# Altium schematic sheet MCU.SchDoc
size 420 x 297 mm; SheetNumber: 2; SheetTotal: 2
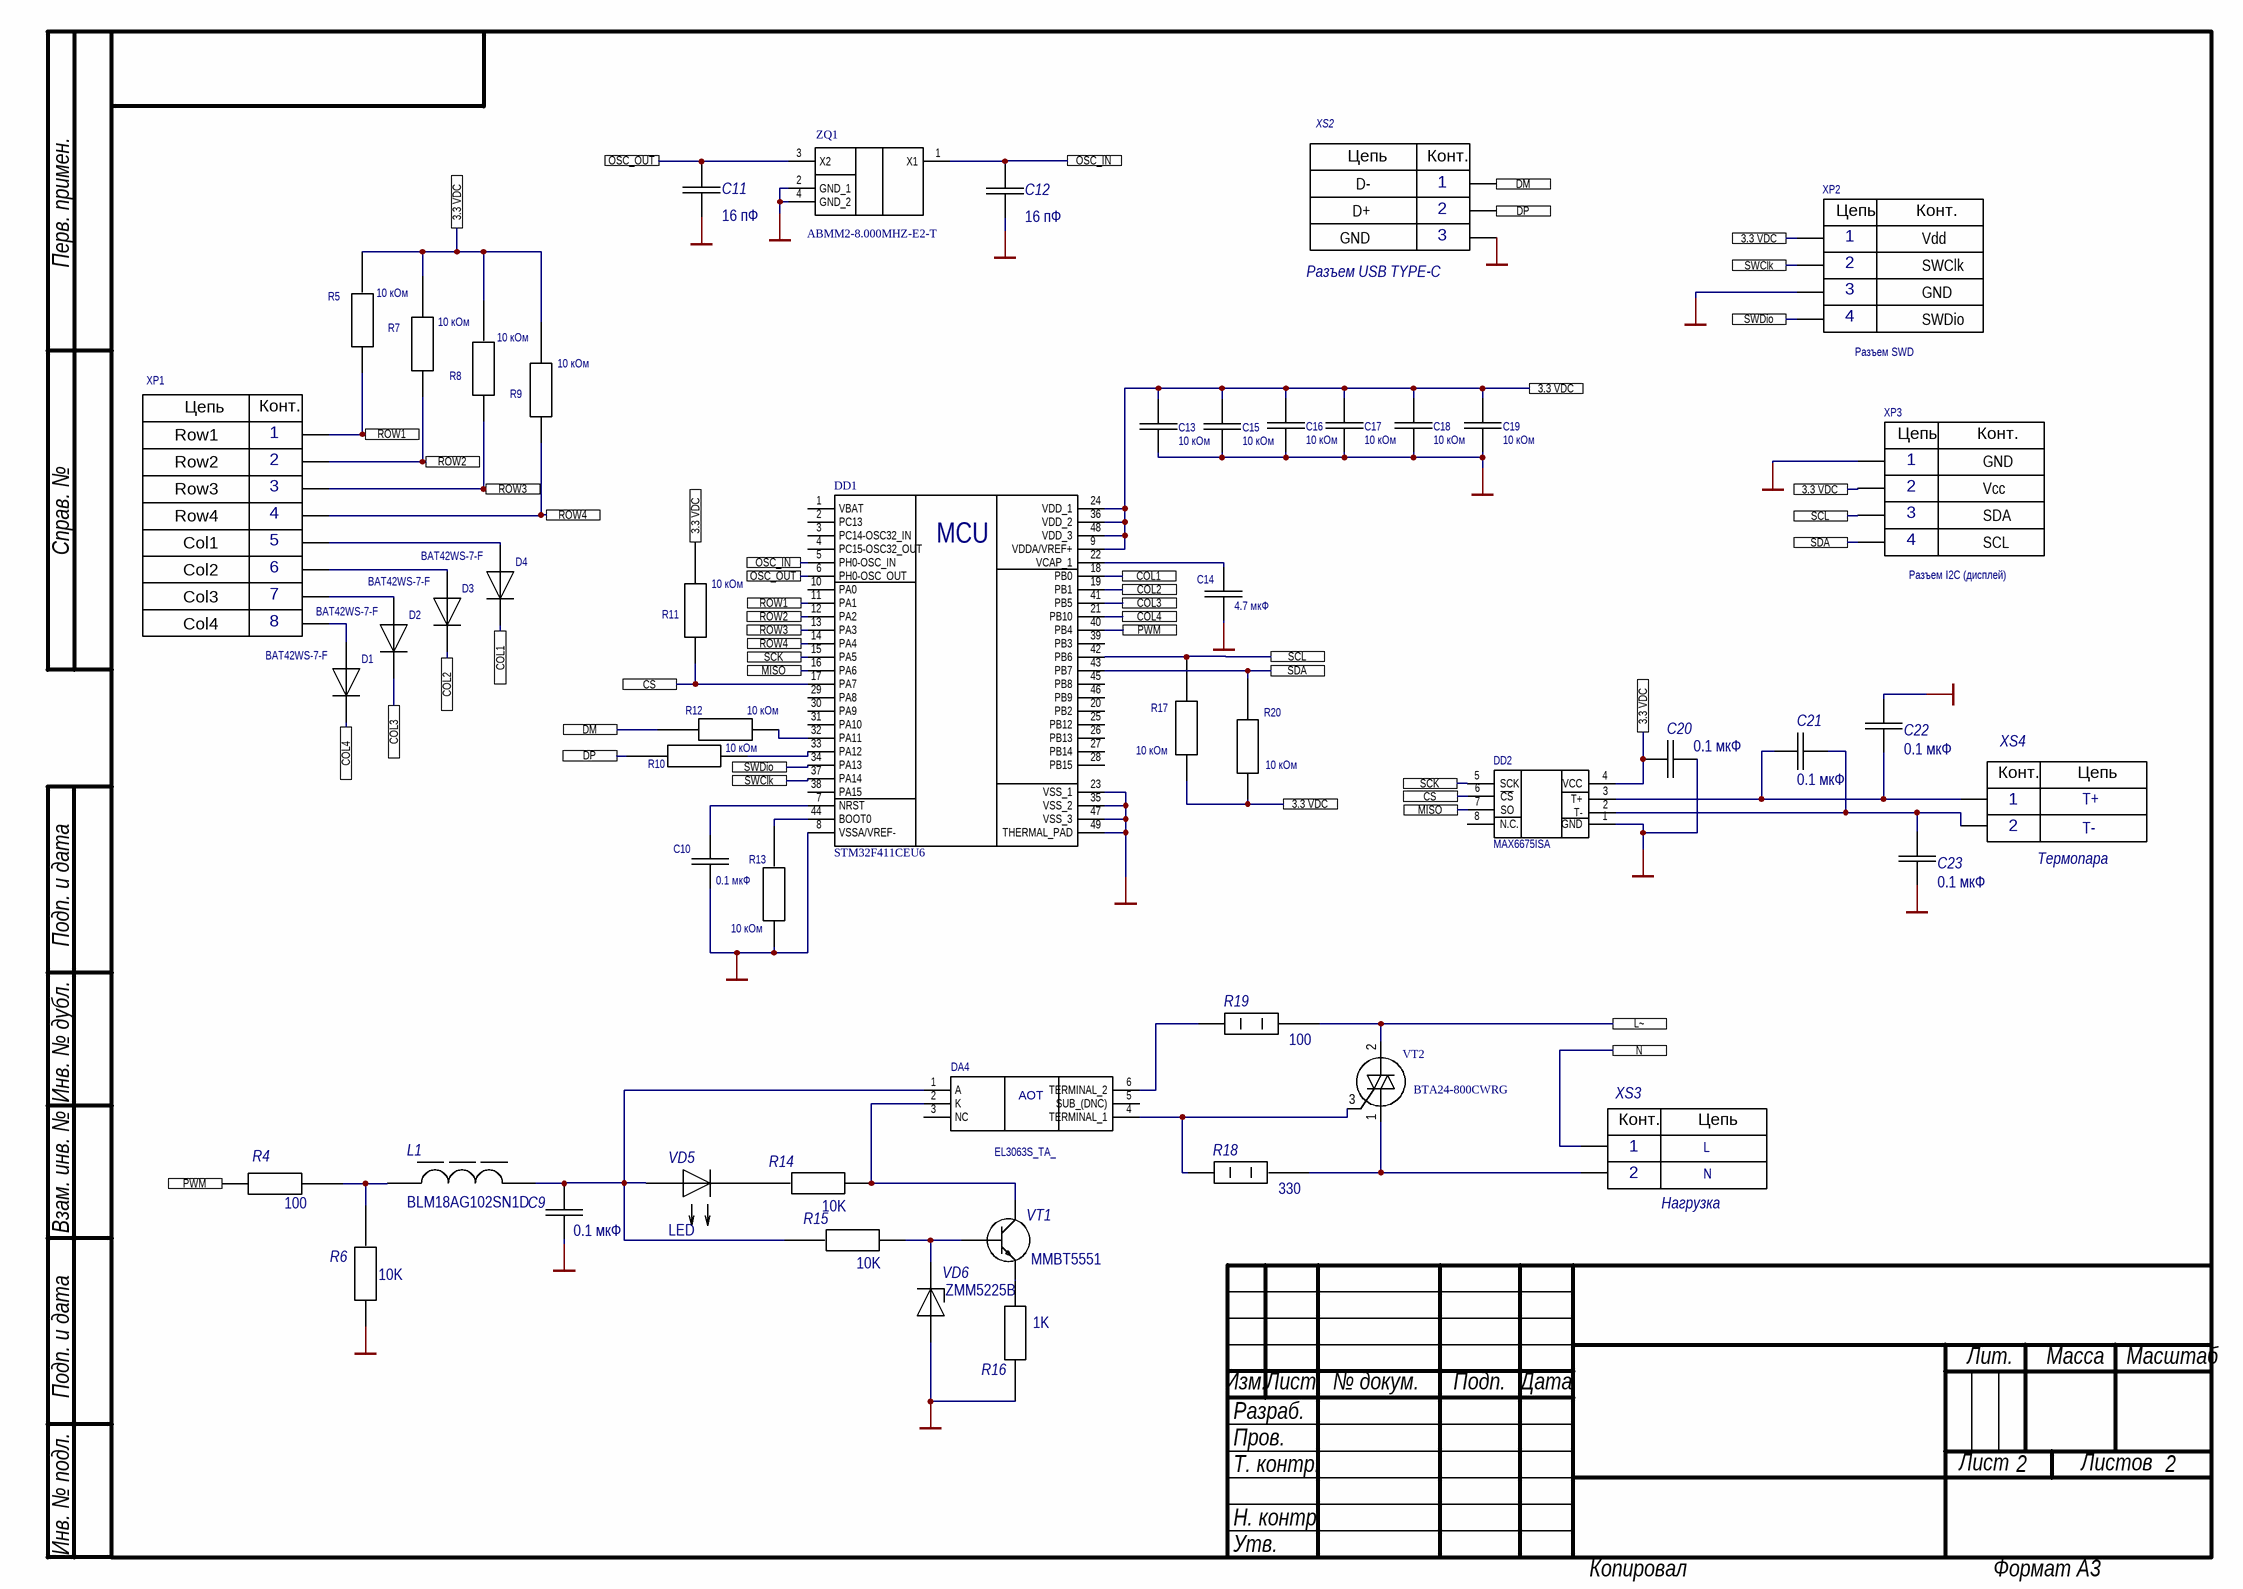
[diagram p0: MCU.SchDoc]

## Parts
C9  value 0.1 мкФ  [С0603]  (hidden comment: 06035C104JAT2A)
C10  value 0.1 мкФ  [С0603]  (hidden comment: 06035C104JAT2A)
C11  value 16 пФ  [C0402]  (hidden comment: CC0603JRNPO9BN160)
C12  value 16 пФ  [C0402]  (hidden comment: CC0603JRNPO9BN160)
C13  value 10 кОм  [С0603]  (hidden comment: 06035C104JAT2A)
C14  value 4.7 мкФ  [С0603]  (hidden comment: 06035C104JAT2A)
C15  value 10 кОм  [С0603]  (hidden comment: 06035C104JAT2A)
C16  value 10 кОм  [С0603]  (hidden comment: 06035C104JAT2A)
C17  value 10 кОм  [С0603]  (hidden comment: 06035C104JAT2A)
C18  value 10 кОм  [С0603]  (hidden comment: 06035C104JAT2A)
C19  value 10 кОм  [С0603]  (hidden comment: 06035C104JAT2A)
C20  value 0.1 мкФ  [С0603]  (hidden comment: 06035C104JAT2A)
C21  value 0.1 мкФ  [С0603]  (hidden comment: 06035C104JAT2A)
C22  value 0.1 мкФ  [С0603]  (hidden comment: 06035C104JAT2A)
C23  value 0.1 мкФ  [С0603]  (hidden comment: 06035C104JAT2A)
D1  BAT42WS-7-F  [SOD2513X120N]
D2  BAT42WS-7-F  [SOD2513X120N]
D3  BAT42WS-7-F  [SOD2513X120N]
D4  BAT42WS-7-F  [SOD2513X120N]
DA4  EL3063S_TA_  [SOP254P1030X460-6N]
DD1  STM32F411CEU6  [QFN50P700X700X60-49N-D]
DD2  MAX6675ISA  [SOIC127P600X175-8N]
L1  BLM18AG102SN1D  [BLM18SP221SN1B]
R4  value 100  [R0402]  (hidden comment: R0402)
R5  value 10 кОм  [R0402]  (hidden comment: R0402)
R6  value 10K  [R0402]  (hidden comment: R0402)
R7  value 10 кОм  [R0402]  (hidden comment: R0402)
R8  value 10 кОм  [R0402]  (hidden comment: R0402)
R9  value 10 кОм  [R0402]  (hidden comment: R0402)
R10  value 10 кОм  [R0402]  (hidden comment: R0402)
R11  value 10 кОм  [R0402]  (hidden comment: R0402)
R12  value 10 кОм  [R0402]  (hidden comment: R0402)
R13  value 10 кОм  [R0402]  (hidden comment: R0402)
R14  value 10K  [R0402]  (hidden comment: R0402)
R15  value 10K  [R0402]  (hidden comment: R0402)
R16  value 1K  [R0402]  (hidden comment: R0402)
R17  value 10 кОм  [R0402]  (hidden comment: R0402)
R18  value 330  [RESC5025X65N]  (hidden comment: RC2010JK-07330RL)
R19  value 100  [RESC5025X65N]  (hidden comment: RC2010FK-07100RL)
R20  value 10 кОм  [R0402]  (hidden comment: R0402)
VD5  LED  [LED Red 5 мм]
VD6  ZMM5225B  [TMMDB3TG]
VT1  MMBT5551  [MMBT5551]
VT2  BTA24-800CWRG  [TO255P460X1020X2005-3P]
XP1  PLS3  [PLS8]  (value not drawn)
XP2  Разъем SWD  [PLS4]
XP3  Разъем I2C (дисплей)  [PLS4]
XS2  Разъем USB TYPE-C  [Разъем USB TYPE-C, 1054500101]
XS3  Нагрузка  [ED350V-02P]
XS4  Термопара  [S2B-PH-K-S]
ZQ1  ABMM2-8.000MHZ-E2-T  [ABMM2]

## Ports
3.3 VDC, COL1, COL2, COL3, COL4, CS, DM, DP, L~, MISO, N, OSC_IN, OSC_OUT, PWM, ROW1, ROW2, ROW3, ROW4, SCK, SCL, SDA, SWClk, SWDio

## Nets
DGND: C9.1 C10.2 C11.2 C12.2 C13.1 C14.1 C15.1 C16.1 C17.1 C18.1 C19.1 C20.1 C22.2 C23.1 DD1.8(VSSA/VREF-) DD1.23(VSS_1) DD1.35(VSS_2) DD1.47(VSS_3) DD1.49(THERMAL_PAD) DD2.1(GND) R6.1 R13.1 R16.2 VD6.2(A) XP2.3(GND) XP3.1(GND) XS2.A1(GND) ZQ1.2(GND_1) ZQ1.4(GND_2)
3.3 VDC: C13.2 C15.2 C16.2 C17.2 C18.2 C19.2 C20.2 DD1.9(VDDA/VREF+) DD1.24(VDD_1) DD1.36(VDD_2) DD1.48(VDD_3) DD2.4(VCC) R5.2 R7.2 R8.2 R9.2 R11.2 R17.1 R20.1 XP2.1(Vdd) XP3.2(Vcc) ; port 3.3 VDC
COL1: D4.1(K) DD1.18(PB0) ; port COL1
COL2: D3.1(K) DD1.19(PB1) ; port COL2
COL3: D2.1(K) DD1.41(PB5) ; port COL3
COL4: D1.1(K) DD1.21(PB10) ; port COL4
CS: DD1.17(PA7) DD2.6(~{CS}) R11.1 ; port CS
DM: R12.2 XS2.A7(D-) ; port DM
DP: R10.2 XS2.A6(D+) ; port DP
L~: R19.2 VT2.2(A2) ; port L~
MISO: DD1.16(PA6) DD2.7(SO) ; port MISO
N: XS3.1 ; port N
OSC_IN: C12.1 DD1.5(PH0-OSC_IN) ZQ1.1(X1) ; port OSC_IN
OSC_OUT: C11.1 DD1.6(PH0-OSC_OUT) ZQ1.3(X2) ; port OSC_OUT
PWM: DD1.40(PB4) R4.1 ; port PWM
ROW1: DD1.11(PA1) R5.1 XP1.1(Row1) ; port ROW1
ROW2: DD1.12(PA2) R7.1 XP1.2(Row2) ; port ROW2
ROW3: DD1.13(PA3) R8.1 XP1.3(Row3) ; port ROW3
ROW4: DD1.14(PA4) R9.1 XP1.4(Row4) ; port ROW4
SCK: DD1.15(PA5) DD2.5(SCK) ; port SCK
SCL: DD1.42(PB6) R17.2 XP3.3(SDA) ; port SCL
SDA: DD1.43(PB7) R20.2 XP3.4(SCL) ; port SDA
SWClk: DD1.37(PA14) XP2.2(SWClk) ; port SWClk
SWDio: DD1.34(PA13) XP2.4(SWDio) ; port SWDio
NetC9_2: C9.2 DA4.1(A) L1.2 R15.2 VD5.1(ANODE)
NetC10_1: C10.1 DD1.7(NRST)
NetC14_2: C14.2 DD1.22(VCAP_1)
NetC21_1: C21.1 C22.1 DD2.3(T+) XS4.1
NetC21_2: C21.2 C23.2 DD2.2(T-) XS4.2
NetD1_2: D1.2(A) XP1.8(Col4)
NetD2_2: D2.2(A) XP1.7(Col3)
NetD3_2: D3.2(A) XP1.6(Col2)
NetD4_2: D4.2(A) XP1.5(Col1)
NetDA4_2: DA4.2(K) R14.1 VT1.3(C)
NetDA4_4: DA4.4(TERMINAL_1) R18.1 VT2.3(G)
NetDA4_6: DA4.6(TERMINAL_2) R19.1
NetDD1_32: DD1.32(PA11) R12.1
NetDD1_33: DD1.33(PA12) R10.1
NetDD1_44: DD1.44(BOOT0) R13.2
NetL1_1: L1.1 R4.2 R6.2
NetR14_2: R14.2 VD5.2(CATHODE)
NetR15_1: R15.1 VD6.1(K) VT1.1(B)
NetR16_1: R16.1 VT1.2(E)
NetR18_2: R18.2 VT2.1(A1) XS3.2

Not connected (* = marked no-connect by the designer): DA4 3(NC) 5(SUB_(DNC)); DD1 1(VBAT) 2(PC13) 3(PC14-OSC32_IN) 4(PC15-OSC32_OUT) 10(PA0) 20(PB2) 25(PB12) 26(PB13) 27(PB14) 28(PB15) 29(PA8) 30(PA9) 31(PA10) 38(PA15) 39(PB3) 45(PB8) 46(PB9); DD2 8(N.C.)

## Notes on the sheet
- T-
- T+
- L
- N
- Перв. примен.
- Справ. №
- Подп. и дата
- Инв. № дубл.
- Взам. инв. №
- Разраб.
- Изм.
- Лист
- № докум.
- Подп.
- Дата
- Лит.
- Масса
- Масштаб
- Пров.
- Т. контр.
- Листов
- Инв. № подл.
- Н. контр.
- Утв.
- Копировал
- Формат А3
- (in symbol EL3063S_TA_) АОТ
- (in symbol PLS8) Цепь; Конт.
- (in symbol STM32F411CEU6) MCU
- (in symbol Разъем) Конт.; Цепь
- (in symbol Разъем I2C (4)) Цепь; Конт.
- (in symbol Разъем SWD) Цепь; Конт.
- (in symbol Разъем USB TYPE-C) Цепь; Конт.; 1; 2; 3

## Library data of the parts
C9 C20-C23 = Конденсатор неполярный: Керамический ЧИП-конденсатор 0603 X7R 0.1мкФ ±5% 50В; Manufacturer_Name: KEMET; Manufacturer_Part_Number: CC0402KRX7R7BB222; Datasheet Link: https://componentsearchengine.com/Datasheets/34/CC0402KRX7R7BB222.pdf; Height: 0.55mm
C10 C13-C19 = Конденсатор неполярный: Capacitor; Manufacturer_Name: KEMET; Manufacturer_Part_Number: CC0402KRX7R7BB222; Datasheet Link: https://componentsearchengine.com/Datasheets/34/CC0402KRX7R7BB222.pdf; Height: 0.55mm
C11 C12 = Конденсатор неполярный: 16пФ ±5% 50В; Manufacturer_Name: KEMET; Manufacturer_Part_Number: CC0402KRX7R7BB222; Datasheet Link: https://componentsearchengine.com/Datasheets/34/CC0402KRX7R7BB222.pdf; Height: 0.55mm
D1-D4 = BAT42WS-7-F: Diode; Manufacturer_Name: Diodes Incorporated; Datasheet Link: https://www.diodes.com//assets/Datasheets/ds30100.pdf; Height: 1.2mm; Manufacturer_Part_Number: BAT42WS-7-F; Mouser Part Number: 621-BAT42WS-F; Mouser Price/Stock: https://www.mouser.co.uk/ProductDetail/Diodes-Incorporated/BAT42WS-7-F?qs=m4hD82FvRu0XtK2r8jLwYA%3D%3D; Arrow Part Number: BAT42WS-7-F; Arrow Price/Stock: https://www.arrow.com/en/products/bat42ws-7-f/diodes-incorporated?utm_currency=USD&region=europe
DA4 = EL3063S_TA_: Integrated Circuit; Manufacturer_Name: Everlight; Manufacturer_Part_Number: EL3063S(TA); Datasheet Link: https://www.mouser.com/datasheet/2/143/EL303X_EL304X_EL306X_EL308X-515384.pdf; Height: 4.6mm; Mouser Part Number: 638-EL3063STA; Mouser Price/Stock: https://www.mouser.com/Search/Refine.aspx?Keyword=638-EL3063STA; Arrow Part Number: EL3063S(TA); Arrow Price/Stock: https://www.arrow.com/en/products/el3063s-ta/everlight-electronics
DD1 = STM32F411CEU6: Integrated Circuit; Manufacturer_Name: STMicroelectronics; Datasheet Link: https://www.st.com/resource/en/datasheet/stm32f411ce.pdf; Height: 0.6mm; Manufacturer_Part_Number: STM32F411CEU6; Mouser Part Number: 511-STM32F411CEU6; Mouser Price/Stock: https://www.mouser.co.uk/ProductDetail/STMicroelectronics/STM32F411CEU6?qs=pjMTYa9MTGV3ou31YBFa3g%3D%3D; Arrow Part Number: STM32F411CEU6; Arrow Price/Stock: https://www.arrow.com/en/products/stm32f411ceu6/stmicroelectronics?utm_currency=USD&region=nac
DD2 = MAX6675ISA: Integrated Circuit; Manufacturer_Name: Analog Devices; Datasheet Link: http://datasheets.maximintegrated.com/en/ds/MAX6675.pdf; Height: 1.75mm; Manufacturer_Part_Number: MAX6675ISA; Mouser Part Number: N/A; Mouser Price/Stock: https://www.mouser.com/Search/Refine.aspx?Keyword=N%2FA
L1 = BLM18AG102SN1D: Ferrite Bead; Manufacturer_Name: Murata Electronics; Datasheet Link: http://www.murata.com/~/media/webrenewal/support/library/catalog/products/emc/emifil/c31e.ashx?la=en-gb; Height: 0.95mm; Manufacturer_Part_Number: BLM18AG102SN1D; Mouser Part Number: 81-BLM11A102S; Mouser Price/Stock: https://www.mouser.co.uk/ProductDetail/Murata-Electronics/BLM18AG102SN1D?qs=b2kFoOhrN4V4XjRBmusv4w%3D%3D; Arrow Part Number: BLM18AG102SN1D; Arrow Price/Stock: https://www.arrow.com/en/products/blm18ag102sn1d/murata-manufacturing?utm_currency=USD&region=nac
R4-R17 R20 = Резистор: Units: Ом
R18 R19 = Резистор 2 Вт: Resistor; Manufacturer_Name: TE Connectivity; Manufacturer_Part_Number: CRGS2010J10R; Datasheet Link: http://www.te.com/commerce/DocumentDelivery/DDEController?Action=showdoc&DocId=Data+Sheet%7F9-1773463-8%7FB%7Fpdf%7FEnglish%7FENG_DS_9-1773463-8_B.pdf%7F3-2176251-0; Height: 0.65mm; Mouser Part Number: 279-CRGS2010J10R; Mouser Price/Stock: https://www.mouser.co.uk/ProductDetail/TE-Connectivity-Holsworthy/CRGS2010J10R?qs=Rv6LVDxB0ZqF0MPdEdt49w%3D%3D; Arrow Part Number: CRGS2010J10R; Arrow Price/Stock: https://www.arrow.com/en/products/crgs2010j10r/te-connectivity?utm_currency=USD&region=nac
VD6 = ZMM5225B: Diac; Manufacturer_Name: STMicroelectronics; Datasheet Link: https://www.st.com/resource/en/datasheet/tmmdb3tg.pdf; Height: 1.7mm; Manufacturer_Part_Number: TMMDB3TG; Mouser Part Number: 511-TMMDB3TG; Mouser Price/Stock: https://www.mouser.co.uk/ProductDetail/STMicroelectronics/TMMDB3TG?qs=lgHKUCmDFtju6xjvp%2FOseQ%3D%3D; Arrow Part Number: TMMDB3TG; Arrow Price/Stock: https://www.arrow.com/en/products/tmmdb3tg/stmicroelectronics?region=nac
VT1 = MMBT5551: Transistor BJT NPN; Manufacturer_Name: Guangdong Hottech; Datasheet Link: https://doc.hotking.com/wr/specification/specification-en/MMBT5551_SOT-23.pdf; Height: 1.15mm; Manufacturer_Part_Number: MMBT5551
VT2 = BTA24-800CWRG: Triac A; Manufacturer_Name: STMicroelectronics; Datasheet Link: http://www.st.com/content/ccc/resource/technical/document/datasheet/da/b9/e2/fa/76/a3/40/9b/CD00002264.pdf/files/CD00002264.pdf/jcr:content/translations/en.CD00002264.pdf; Height: 4.6mm; Manufacturer_Part_Number: BTA24-800CWRG; Mouser Part Number: 511-BTA24-800CW; Mouser Price/Stock: https://www.mouser.co.uk/ProductDetail/STMicroelectronics/BTA24-800CWRG?qs=J0fHR8QSRK8TBQKNN3f7Zg%3D%3D; Arrow Part Number: BTA24-800CWRG; Arrow Price/Stock: https://www.arrow.com/en/products/bta24-800cwrg/stmicroelectronics?utm_currency=USD&region=europe
XP1 = PLS8
XP3 = Разъем I2C (4)
XS2 = Разъем USB TYPE-C: 1054500101, Разъем USB TYPE-C, USB 3.1, розетка, 24 вывод(-ов), Поверхностный Монтаж, Прямой Угол, Molex; Value: *
XS3 XS4 = Разъем: Гнездо провод-плата;; Value: *
ZQ1 = ABMM2-8.000MHZ-E2-T: Crystal or Oscillator; Manufacturer_Name: ABRACON; Datasheet Link: https://abracon.com/Resonators/ABMM2.pdf; Height: 1.2mm; Manufacturer_Part_Number: ABMM2-8.000MHZ-E2-T; Mouser Part Number: 815-ABMM2-8-E2T; Mouser Price/Stock: https://www.mouser.co.uk/ProductDetail/ABRACON/ABMM2-8.000MHZ-E2-T?qs=m%252BUhWDcpCfaGlLHGChx47g%3D%3D; Arrow Part Number: ABMM2-8.000MHZ-E2-T; Arrow Price/Stock: https://www.arrow.com/en/products/abmm2-8.000mhz-e2-t/abracon?utm_currency=USD&region=nac